# Altium schematic sheet Action_Split.SchDoc
size A4
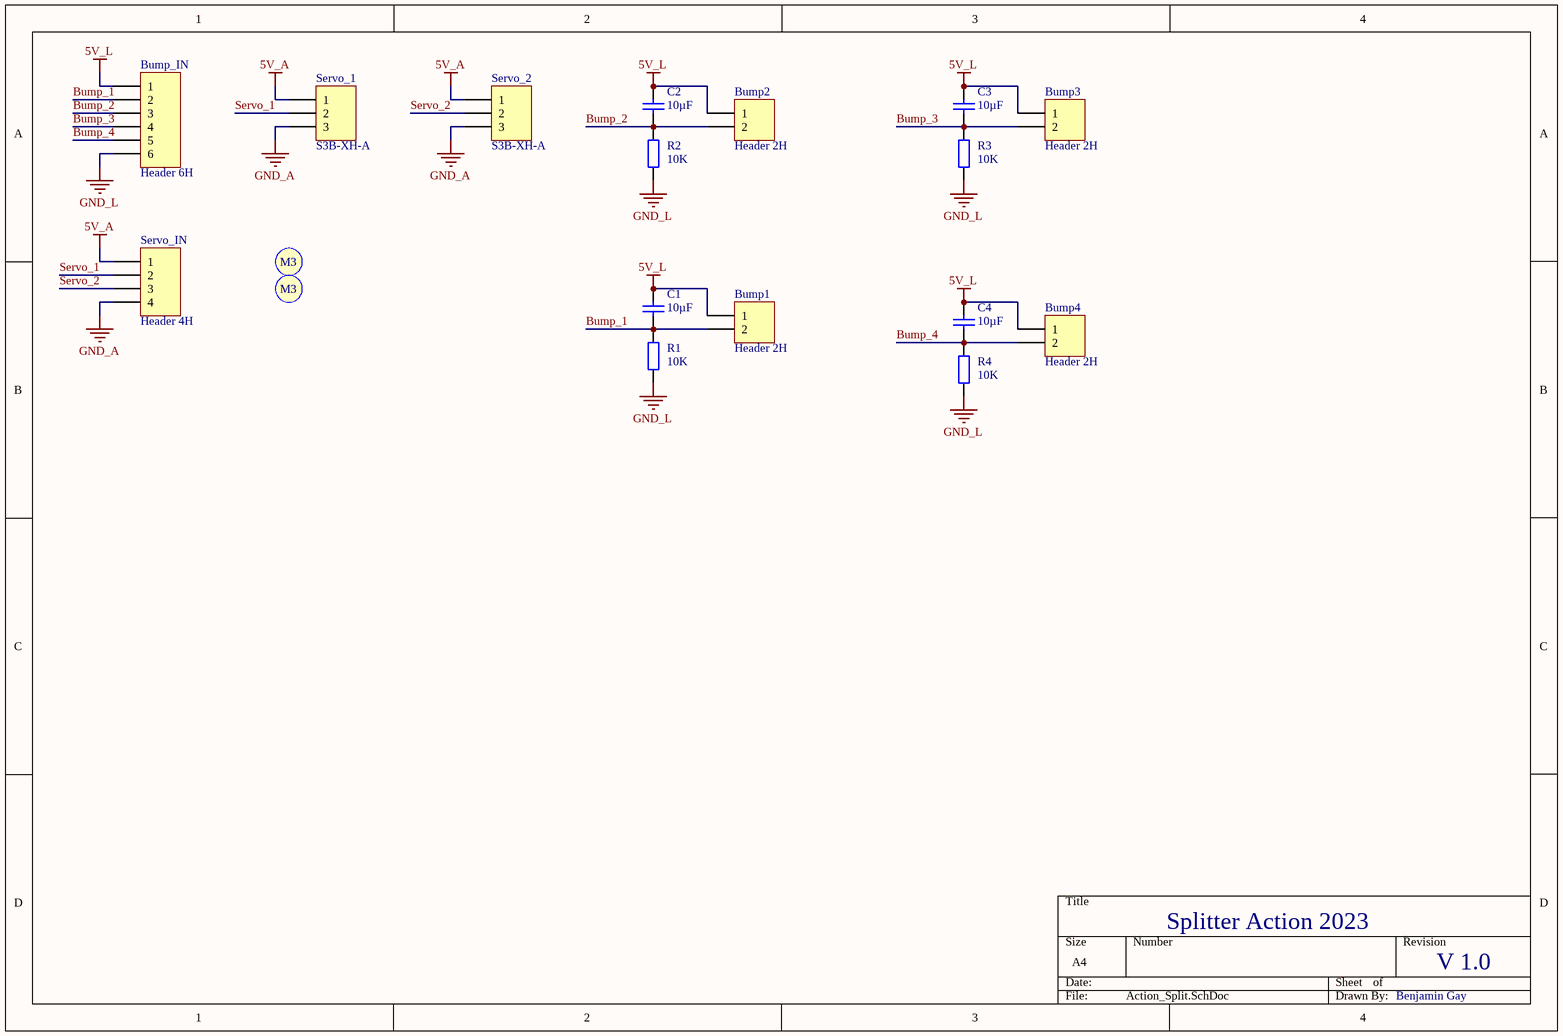
[diagram p0: Action_Split.SchDoc]

## Parts
Bump1  Header 2H  [S2B-XH-A]
Bump2  Header 2H  [S2B-XH-A]
Bump3  Header 2H  [S2B-XH-A]
Bump4  Header 2H  [S2B-XH-A]
Bump_IN  Header 6H  [S6B-XH-A]
C1  value 10µF  [Capacitor 1206]
C2  value 10µF  [Capacitor 1206]
C3  value 10µF  [Capacitor 1206]
C4  value 10µF  [Capacitor 1206]
R1  value 10K  [Resistor 1206]  (hidden comment: Res2)
R2  value 10K  [Resistor 1206]  (hidden comment: Res2)
R3  value 10K  [Resistor 1206]  (hidden comment: Res2)
R4  value 10K  [Resistor 1206]  (hidden comment: Res2)
S1  Screw M3  [Screw M3]  (value not drawn)
S2  Screw M3  [Screw M3]  (value not drawn)
Servo_1  S3B-XH-A  [S3B-XH-A]
Servo_2  S3B-XH-A  [S3B-XH-A]
Servo_IN  Header 4H  [S4B-XH-A]

## Nets
5V_A: Servo_1.1 Servo_2.1 Servo_IN.1
5V_L: Bump1.1 Bump2.1 Bump3.1 Bump4.1 Bump_IN.1 C1.2 C2.2 C3.2 C4.2
GND_A: Servo_1.3 Servo_2.3 Servo_IN.4
GND_L: Bump_IN.6 R1.1 R2.1 R3.1 R4.1
Bump_1: Bump1.2 Bump_IN.2 C1.1 R1.2
Bump_2: Bump2.2 Bump_IN.3 C2.1 R2.2
Bump_3: Bump3.2 Bump_IN.4 C3.1 R3.2
Bump_4: Bump4.2 Bump_IN.5 C4.1 R4.2
Servo_1: Servo_1.2 Servo_IN.2
Servo_2: Servo_2.2 Servo_IN.3

## Notes on the sheet
- Splitter Action 2023
- V 1.0
- Benjamin Gay
- (in symbol Screw M3) M3

## Library data of the parts
Bump1-Bump4 = Header 2H: Header, 2-Pin, Right Angle; LatestRevisionDate: 17-Jul-2002; LatestRevisionNote: Re-released for DXP Platform.; Publisher: Altium Limited
Bump_IN = Header 6H: Header, 6-Pin, Right Angle; LatestRevisionDate: 17-Jul-2002; LatestRevisionNote: Re-released for DXP Platform.; Publisher: Altium Limited
C1-C4 = Cap: Capacitor; Published: 8-Jun-2000; LatestRevisionDate: 17-Jul-2002; LatestRevisionNote: Re-released for DXP Platform.; PackageReference: RAD-0.3; Publisher: Altium Limited; PackageDescription: Radial Cap, Thru-Hole; 2 Leads; 0.3 in Pin Spacing
R1-R4 = Res2: Resistor; Published: 8-Jun-2000; LatestRevisionDate: 17-Jul-2002; LatestRevisionNote: Re-released for DXP Platform.; PackageReference: AXIAL-0.4; Publisher: Altium Limited; PackageDescription: Axial Device, Thru-Hole; 2 Leads; 0.4 in Pin Spacing
Servo_1 Servo_2 = Header 3H: Header, 3-Pin, Right Angle; LatestRevisionDate: 17-Jul-2002; LatestRevisionNote: Re-released for DXP Platform.; Publisher: Altium Limited
Servo_IN = Header 4H: Header, 4-Pin, Right Angle; LatestRevisionDate: 17-Jul-2002; LatestRevisionNote: Re-released for DXP Platform.; Publisher: Altium Limited